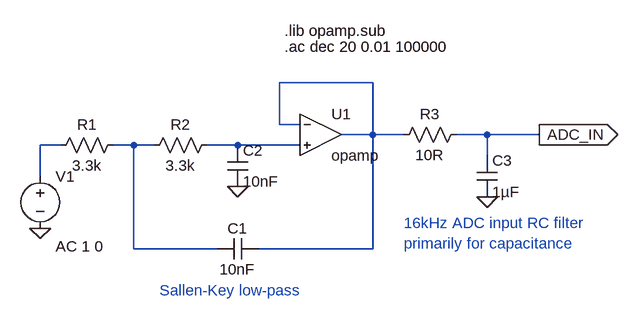
[diagram p0: schematic sk2_filter_3kHz.asc]
sk2_filter_3kHz.asc, the LTspice schematic file:
Version 4.1
SHEET 1 900 680
WIRE 400 80 256 80
WIRE 256 144 256 80
WIRE 288 144 256 144
WIRE 400 160 400 80
WIRE 400 160 352 160
WIRE 448 160 400 160
WIRE 576 160 528 160
WIRE 656 160 576 160
WIRE -80 176 -112 176
WIRE 32 176 0 176
WIRE 64 176 32 176
WIRE 192 176 144 176
WIRE 288 176 192 176
WIRE 576 192 576 160
WIRE -112 224 -112 176
WIRE 32 336 32 176
WIRE 160 336 32 336
WIRE 400 336 400 160
WIRE 400 336 224 336
FLAG -112 304 0
FLAG 192 240 0
FLAG 576 256 0
FLAG 656 160 ADC_IN
IOPIN 656 160 Out
SYMBOL OpAmps\\opamp 320 96 R0
SYMATTR InstName U1
SYMBOL cap 224 320 R90
WINDOW 0 0 32 VBottom 2
WINDOW 3 32 32 VTop 2
SYMATTR InstName C1
SYMATTR Value 10nF
SYMBOL cap 176 176 R0
SYMATTR InstName C2
SYMATTR Value 10nF
SYMBOL res 16 160 R90
WINDOW 0 0 56 VBottom 2
WINDOW 3 32 56 VTop 2
SYMATTR InstName R1
SYMATTR Value 3.3k
SYMBOL res 160 160 R90
WINDOW 0 0 56 VBottom 2
WINDOW 3 32 56 VTop 2
SYMATTR InstName R2
SYMATTR Value 3.3k
SYMBOL voltage -112 208 R0
WINDOW 123 24 124 Left 2
WINDOW 39 0 0 Left 0
SYMATTR Value2 AC 1 0
SYMATTR InstName V1
SYMATTR Value ""
SYMBOL res 544 144 R90
WINDOW 0 0 56 VBottom 2
WINDOW 3 32 56 VTop 2
SYMATTR InstName R3
SYMATTR Value 10R
SYMBOL cap 560 192 R0
SYMATTR InstName C3
SYMATTR Value 1µF
TEXT 264 24 Left 2 !.ac dec 20 0.01 100000
TEXT 264 0 Left 2 !.lib opamp.sub
TEXT 448 296 Left 2 ;16kHz ADC input RC filter\nprimarily for capacitance
TEXT 72 400 Left 2 ;Sallen-Key low-pass

The netlist it stands for:
* sk2_filter_3kHz.asc
X§U1 N001 N004 N001 opamp Aol=100K GBW=10Meg  ; pins invin noninvin out
C1 N001 N003 10nF
C2 N004 0 10nF
R1 N003 N002 3.3k
R2 N004 N003 3.3k
V1 N002 0 AC 1 0
R3 ADC_IN N001 10R
C3 ADC_IN 0 1µF
.ac dec 20 0.01 100000
.lib opamp.sub
* 16kHz ADC input RC filter
* primarily for capacitance
* Sallen-Key low-pass
.backanno
.end

* Results of the author's LTspice run, read from the files saved beside the schematic
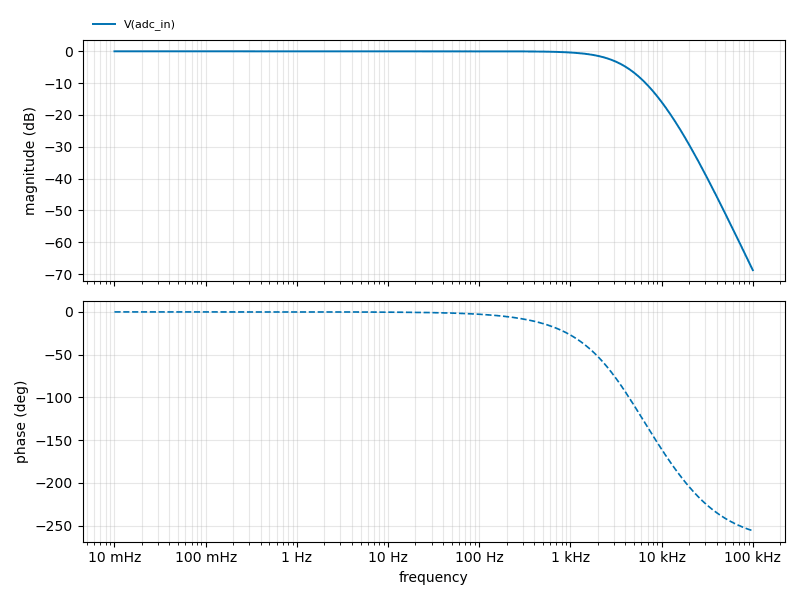
[diagram p1: AC Analysis of sk2_filter_3kHz.asc, plotted from the saved traces]
* AC Analysis, 1 run:
*   V(adc_in): -0.00 dB at 10 mHz, -68.76 dB at 100 kHz, peak -0.00 dB at 10 mHz, 3 dB below the peak at 3.003 kHz